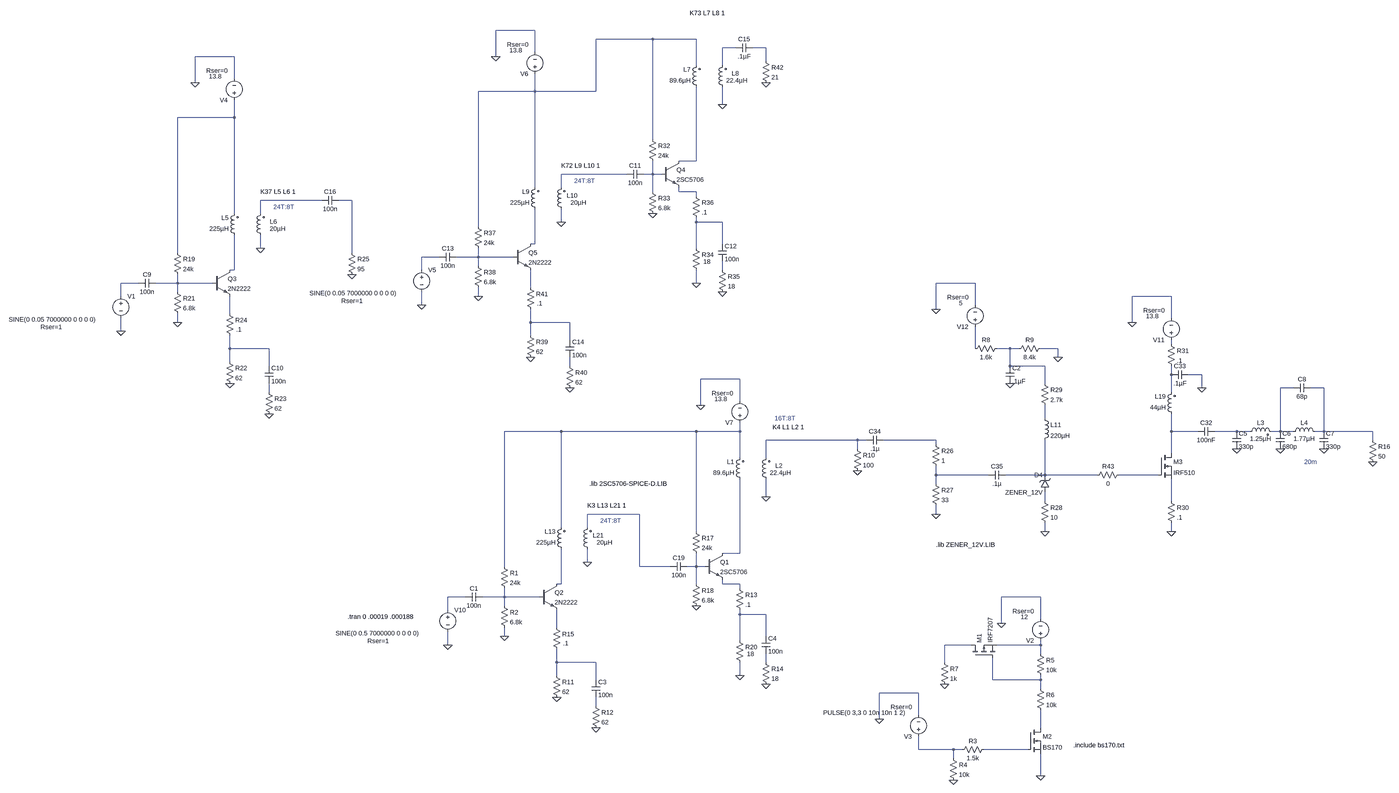
[diagram p0: schematic SSB Amp 7 MHz v2.asc, whole sheet]
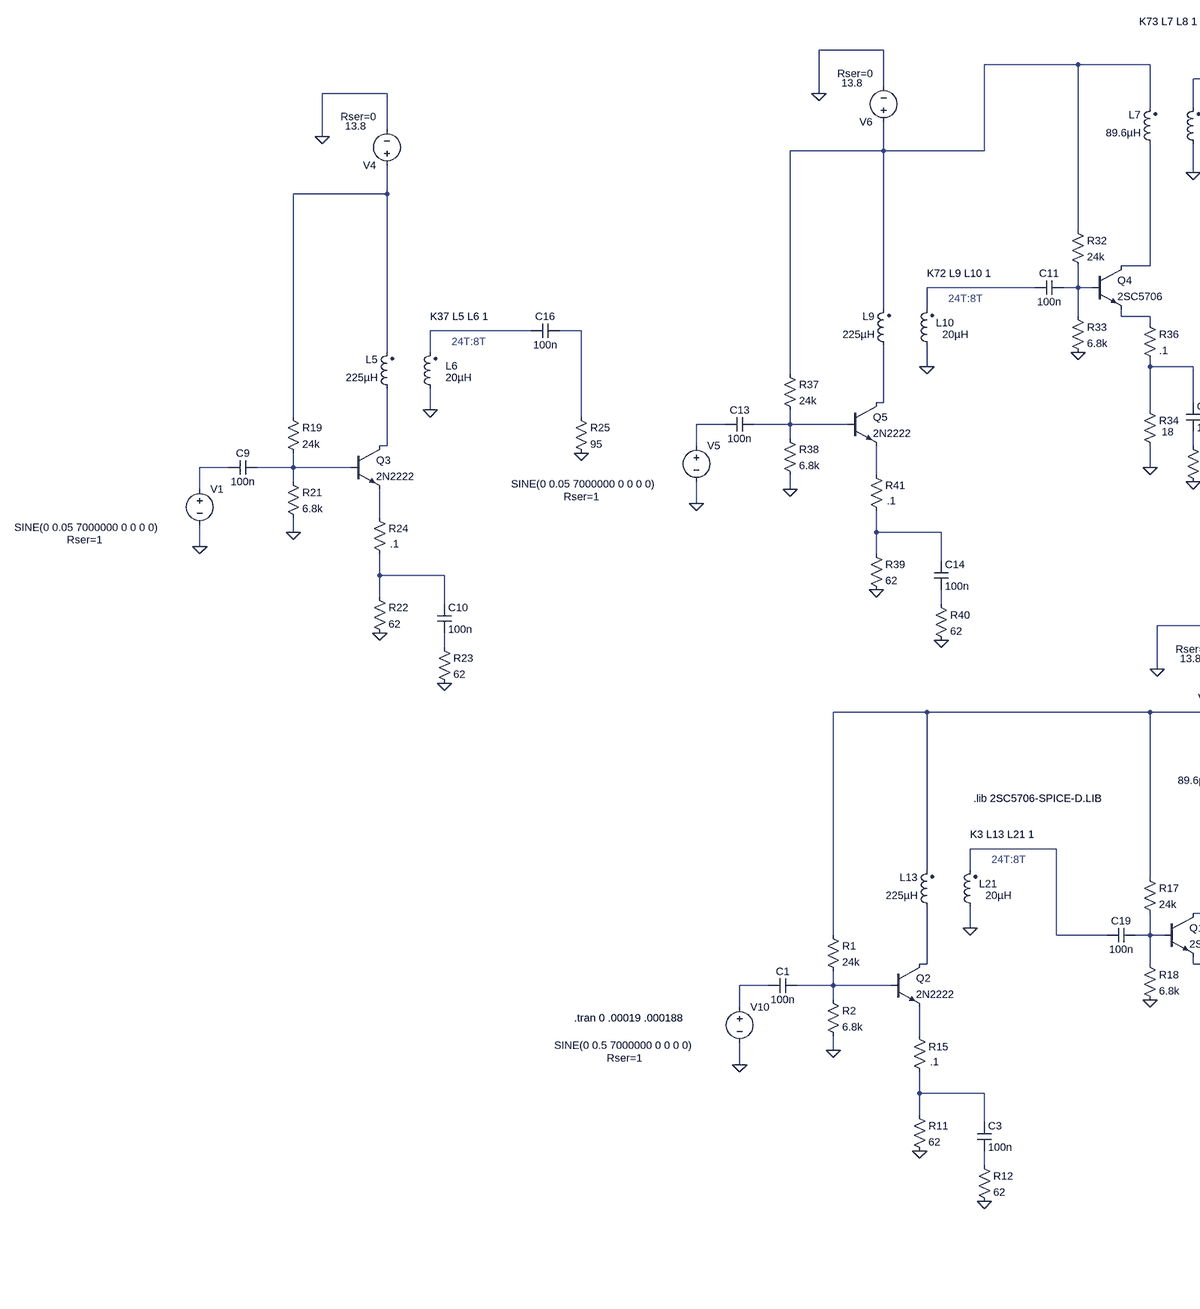
[diagram p1: schematic SSB Amp 7 MHz v2.asc, part, row 1 of 1, column 1 of 2]
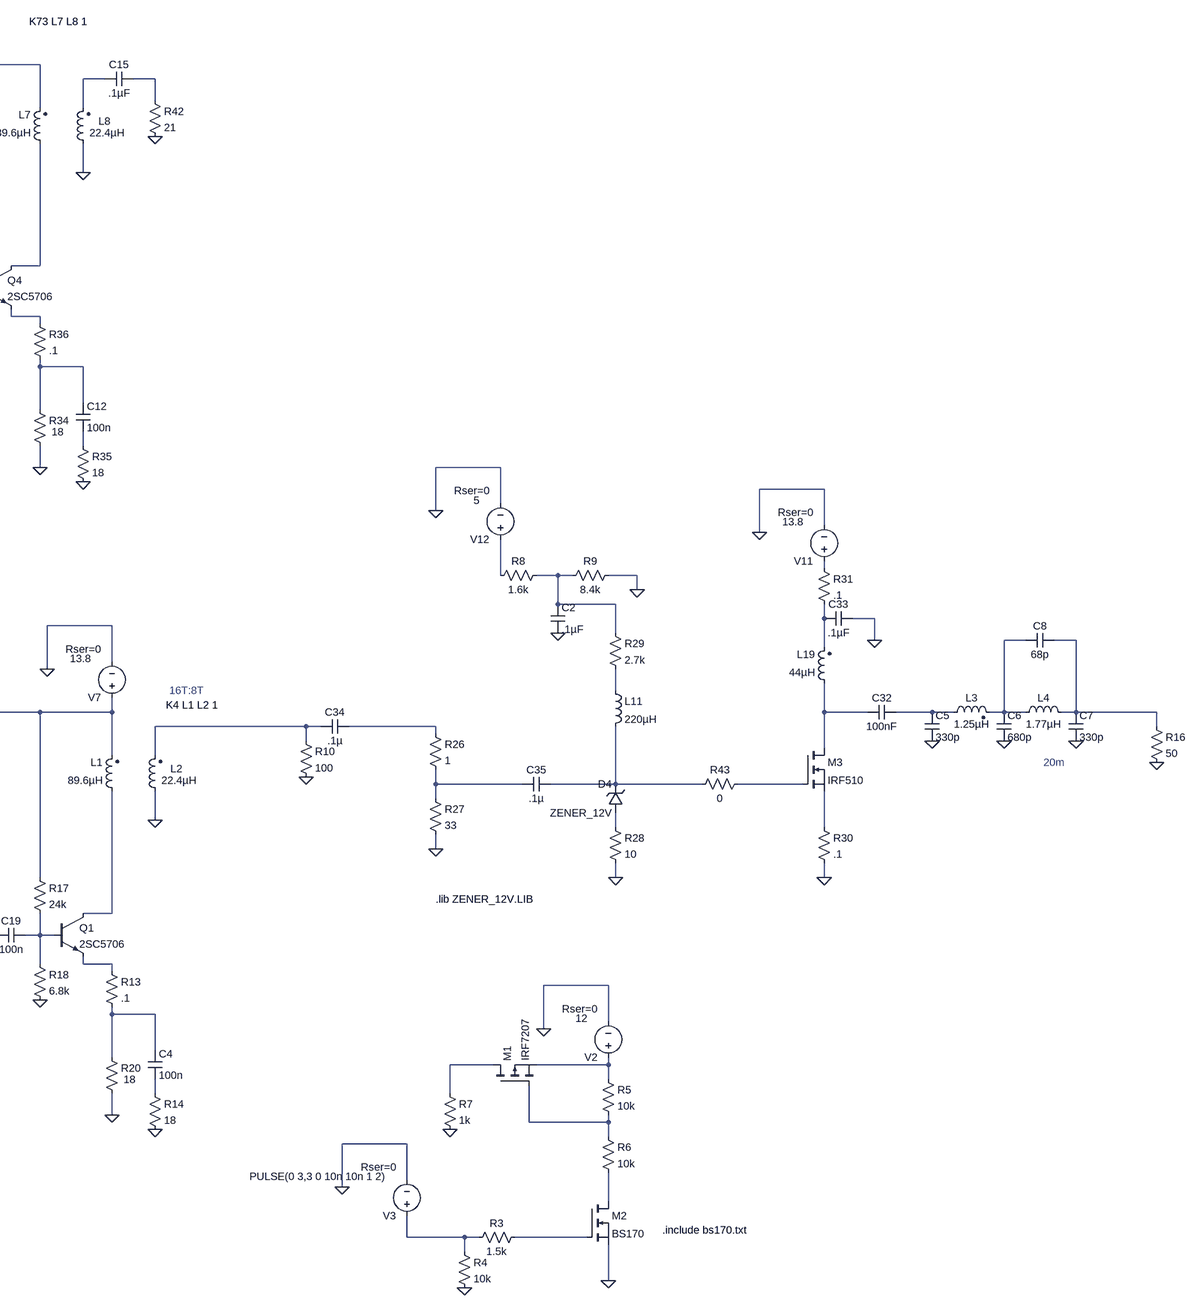
[diagram p2: schematic SSB Amp 7 MHz v2.asc, part, row 1 of 1, column 2 of 2]
SSB Amp 7 MHz v2.asc, the LTspice schematic file:
Version 4
SHEET 1 3764 1240
WIRE -1440 -4448 -1584 -4448
WIRE -1008 -4416 -1216 -4416
WIRE -848 -4416 -1008 -4416
WIRE -704 -4384 -752 -4384
WIRE -592 -4384 -640 -4384
WIRE -1440 -4368 -1440 -4448
WIRE -2544 -4352 -2688 -4352
WIRE -1584 -4352 -1584 -4448
WIRE -592 -4336 -592 -4384
WIRE -848 -4320 -848 -4416
WIRE -752 -4320 -752 -4384
WIRE -2544 -4272 -2544 -4352
WIRE -2688 -4256 -2688 -4352
WIRE -1440 -4224 -1440 -4288
WIRE -1440 -4224 -1648 -4224
WIRE -1216 -4224 -1216 -4416
WIRE -1216 -4224 -1440 -4224
WIRE -752 -4176 -752 -4240
WIRE -2544 -4128 -2544 -4192
WIRE -2544 -4128 -2752 -4128
WIRE -1008 -4048 -1008 -4416
WIRE -848 -3968 -848 -4240
WIRE -848 -3968 -912 -3968
WIRE -1104 -3920 -1344 -3920
WIRE -1008 -3920 -1008 -3968
WIRE -1008 -3920 -1040 -3920
WIRE -976 -3920 -1008 -3920
WIRE -1440 -3872 -1440 -4224
WIRE -1344 -3872 -1344 -3920
WIRE -1008 -3856 -1008 -3920
WIRE -912 -3856 -912 -3872
WIRE -848 -3856 -912 -3856
WIRE -848 -3840 -848 -3856
WIRE -2224 -3824 -2448 -3824
WIRE -2112 -3824 -2160 -3824
WIRE -2544 -3776 -2544 -4128
WIRE -2448 -3776 -2448 -3824
WIRE -1344 -3744 -1344 -3792
WIRE -848 -3744 -848 -3760
WIRE -752 -3744 -848 -3744
WIRE -1648 -3728 -1648 -4224
WIRE -1440 -3664 -1440 -3792
WIRE -1440 -3664 -1456 -3664
WIRE -752 -3664 -752 -3744
WIRE -2448 -3648 -2448 -3696
WIRE -848 -3648 -848 -3744
WIRE -2752 -3632 -2752 -4128
WIRE -2112 -3632 -2112 -3824
WIRE -1792 -3616 -1856 -3616
WIRE -1648 -3616 -1648 -3648
WIRE -1648 -3616 -1728 -3616
WIRE -1520 -3616 -1648 -3616
WIRE -1648 -3584 -1648 -3616
WIRE -2544 -3568 -2544 -3696
WIRE -2544 -3568 -2560 -3568
WIRE -1856 -3568 -1856 -3616
WIRE -752 -3568 -752 -3600
WIRE -2896 -3520 -2960 -3520
WIRE -2752 -3520 -2752 -3552
WIRE -2752 -3520 -2832 -3520
WIRE -2624 -3520 -2752 -3520
WIRE -848 -3520 -848 -3568
WIRE 176 -3520 32 -3520
WIRE -1456 -3504 -1456 -3568
WIRE -2752 -3488 -2752 -3520
WIRE -2960 -3472 -2960 -3520
WIRE -1648 -3472 -1648 -3504
WIRE 896 -3472 752 -3472
WIRE -1856 -3440 -1856 -3488
WIRE 176 -3440 176 -3520
WIRE 32 -3424 32 -3520
WIRE -2560 -3408 -2560 -3472
WIRE 896 -3392 896 -3472
WIRE -2752 -3376 -2752 -3408
WIRE -1456 -3376 -1456 -3424
WIRE -1312 -3376 -1456 -3376
WIRE 752 -3376 752 -3472
WIRE -2960 -3344 -2960 -3392
WIRE -1456 -3328 -1456 -3376
WIRE -1312 -3312 -1312 -3376
WIRE 896 -3296 896 -3312
WIRE -2560 -3280 -2560 -3328
WIRE -2416 -3280 -2560 -3280
WIRE 176 -3280 176 -3360
WIRE 304 -3280 256 -3280
WIRE 336 -3280 304 -3280
WIRE 480 -3280 416 -3280
WIRE 480 -3248 480 -3280
WIRE -2560 -3232 -2560 -3280
WIRE -2416 -3216 -2416 -3280
WIRE -1312 -3216 -1312 -3248
WIRE 304 -3216 304 -3280
WIRE 432 -3216 304 -3216
WIRE 896 -3184 896 -3216
WIRE 1008 -3184 960 -3184
WIRE -688 -3168 -832 -3168
WIRE 432 -3152 432 -3216
WIRE 1008 -3136 1008 -3184
WIRE 1344 -3136 1296 -3136
WIRE 1456 -3136 1408 -3136
WIRE -2416 -3120 -2416 -3152
WIRE 896 -3120 896 -3184
WIRE -688 -3088 -688 -3168
WIRE -832 -3072 -832 -3168
WIRE 432 -3024 432 -3072
WIRE -1344 -2976 -1552 -2976
WIRE -848 -2976 -1344 -2976
WIRE -688 -2976 -688 -3008
WIRE -688 -2976 -848 -2976
WIRE 896 -2976 896 -3040
WIRE 992 -2976 896 -2976
WIRE 1136 -2976 1056 -2976
WIRE 1184 -2976 1136 -2976
WIRE 1296 -2976 1296 -3136
WIRE 1296 -2976 1264 -2976
WIRE 1344 -2976 1296 -2976
WIRE 1456 -2976 1456 -3136
WIRE 1456 -2976 1424 -2976
WIRE 1824 -2976 1456 -2976
WIRE -256 -2944 -592 -2944
WIRE -224 -2944 -256 -2944
WIRE 32 -2944 -160 -2944
WIRE 1824 -2944 1824 -2976
WIRE 32 -2928 32 -2944
WIRE -256 -2912 -256 -2944
WIRE 896 -2896 896 -2976
WIRE -688 -2880 -688 -2976
WIRE -592 -2880 -592 -2944
WIRE 32 -2816 32 -2848
WIRE 224 -2816 32 -2816
WIRE 432 -2816 432 -2944
WIRE 432 -2816 288 -2816
WIRE 624 -2816 432 -2816
WIRE 848 -2816 704 -2816
WIRE 32 -2784 32 -2816
WIRE -592 -2736 -592 -2800
WIRE 432 -2720 432 -2752
WIRE 896 -2720 896 -2800
WIRE -1056 -2672 -1248 -2672
WIRE 32 -2672 32 -2704
WIRE -1344 -2624 -1344 -2976
WIRE -1248 -2624 -1248 -2672
WIRE -848 -2608 -848 -2976
WIRE 432 -2608 432 -2640
WIRE 896 -2608 896 -2640
WIRE -688 -2528 -688 -2800
WIRE -688 -2528 -752 -2528
WIRE -1248 -2496 -1248 -2544
WIRE -1552 -2480 -1552 -2976
WIRE -1056 -2480 -1056 -2672
WIRE -944 -2480 -1056 -2480
WIRE -848 -2480 -848 -2528
WIRE -848 -2480 -880 -2480
WIRE -816 -2480 -848 -2480
WIRE -1344 -2416 -1344 -2544
WIRE -1344 -2416 -1360 -2416
WIRE -848 -2416 -848 -2480
WIRE -752 -2416 -752 -2432
WIRE -688 -2416 -752 -2416
WIRE -688 -2400 -688 -2416
WIRE -1696 -2368 -1760 -2368
WIRE -1552 -2368 -1552 -2400
WIRE -1552 -2368 -1632 -2368
WIRE -1424 -2368 -1552 -2368
WIRE 416 -2368 272 -2368
WIRE -1552 -2336 -1552 -2368
WIRE -1760 -2320 -1760 -2368
WIRE -688 -2304 -688 -2320
WIRE -592 -2304 -688 -2304
WIRE 416 -2288 416 -2368
WIRE 272 -2272 272 -2368
WIRE -1360 -2256 -1360 -2320
WIRE -1552 -2224 -1552 -2256
WIRE -592 -2224 -592 -2304
WIRE -688 -2208 -688 -2304
WIRE -1760 -2192 -1760 -2240
WIRE 160 -2192 64 -2192
WIRE 416 -2192 416 -2208
WIRE 416 -2192 256 -2192
WIRE 416 -2160 416 -2192
WIRE -1360 -2128 -1360 -2176
WIRE -1216 -2128 -1360 -2128
WIRE -592 -2128 -592 -2160
WIRE 64 -2128 64 -2192
WIRE -1360 -2080 -1360 -2128
WIRE -688 -2080 -688 -2128
WIRE -1216 -2064 -1216 -2128
WIRE 240 -2064 240 -2144
WIRE 416 -2064 416 -2080
WIRE 416 -2064 240 -2064
WIRE 416 -2032 416 -2064
WIRE -32 -2016 -176 -2016
WIRE -1216 -1968 -1216 -2000
WIRE -32 -1936 -32 -2016
WIRE -176 -1920 -176 -2016
WIRE 416 -1888 416 -1952
WIRE -32 -1808 -32 -1856
WIRE 96 -1808 -32 -1808
WIRE 128 -1808 96 -1808
WIRE 368 -1808 208 -1808
WIRE 96 -1776 96 -1808
WIRE 416 -1712 416 -1792
FLAG -832 -3072 0
FLAG -848 -2336 0
FLAG -688 -2080 0
FLAG -1760 -2192 0
FLAG 752 -3376 0
FLAG 1008 -3136 0
FLAG 32 -2672 0
FLAG 432 -2608 0
FLAG 896 -2608 0
FLAG 32 -3424 0
FLAG -1552 -2224 0
FLAG 416 -1712 0
FLAG 96 -1696 0
FLAG 272 -2272 0
FLAG -176 -1920 0
FLAG 64 -2048 0
FLAG 480 -3248 0
FLAG 304 -3152 0
FLAG -256 -2832 0
FLAG -1360 -2000 0
FLAG -1216 -1888 0
FLAG -1248 -2496 0
FLAG -592 -2048 0
FLAG -592 -2736 0
FLAG 1824 -2864 0
FLAG 1136 -2912 0
FLAG 1296 -2912 0
FLAG 1456 -2912 0
FLAG -2960 -3344 0
FLAG -2752 -3376 0
FLAG -2560 -3152 0
FLAG -2416 -3040 0
FLAG -2448 -3648 0
FLAG -2112 -3552 0
FLAG -2688 -4256 0
FLAG -1008 -3776 0
FLAG -848 -3520 0
FLAG -752 -3488 0
FLAG -752 -4176 0
FLAG -1856 -3440 0
FLAG -1648 -3472 0
FLAG -1456 -3248 0
FLAG -1312 -3136 0
FLAG -1344 -3744 0
FLAG -1584 -4352 0
FLAG -592 -4256 0
SYMBOL npn -816 -2528 R0
SYMATTR InstName Q1
SYMATTR Value 2SC5706
SYMBOL voltage -688 -2992 R180
WINDOW 123 0 0 Left 0
WINDOW 39 24 124 Left 2
WINDOW 3 46 103 Left 2
SYMATTR SpiceLine Rser=0
SYMATTR Value 13.8
SYMATTR InstName V7
SYMBOL npn -1424 -2416 R0
SYMATTR InstName Q2
SYMATTR Value 2N2222
SYMBOL cap -880 -2496 R90
WINDOW 0 0 32 VBottom 2
WINDOW 3 32 32 VTop 2
SYMATTR InstName C19
SYMATTR Value 100n
SYMBOL res -864 -2624 R0
SYMATTR InstName R17
SYMATTR Value 24k
SYMBOL res -864 -2432 R0
SYMATTR InstName R18
SYMATTR Value 6.8k
SYMBOL ind2 -1328 -2528 R180
WINDOW 0 36 80 Left 2
WINDOW 3 36 40 Left 2
SYMATTR InstName L13
SYMATTR Value 225µH
SYMATTR Type ind
SYMBOL res -704 -2224 R0
WINDOW 3 42 65 Left 2
SYMATTR Value 18
SYMATTR InstName R20
SYMBOL voltage -1760 -2336 R0
WINDOW 123 0 0 Left 0
WINDOW 39 -295 129 Left 2
WINDOW 3 -412 101 Left 2
SYMATTR SpiceLine Rser=1
SYMATTR Value SINE(0 0.5 7000000 0 0 0 0)
SYMATTR InstName V10
SYMBOL voltage 896 -3296 R180
WINDOW 123 0 0 Left 0
WINDOW 39 24 124 Left 2
WINDOW 3 46 103 Left 2
SYMATTR SpiceLine Rser=0
SYMATTR Value 13.8
SYMATTR InstName V11
SYMBOL ind2 912 -3024 R180
WINDOW 0 36 80 Left 2
WINDOW 3 36 40 Left 2
SYMATTR InstName L19
SYMATTR Value 44µH
SYMATTR Type ind
SYMBOL cap 1056 -2992 R90
WINDOW 0 0 32 VBottom 2
WINDOW 3 32 32 VTop 2
SYMATTR InstName C32
SYMATTR Value 100nF
SYMBOL ind2 -1232 -2528 R180
WINDOW 0 -45 66 Left 2
WINDOW 3 -76 40 Left 2
SYMATTR InstName L21
SYMATTR Value 20µH
SYMATTR Type ind
SYMBOL cap 960 -3200 R90
WINDOW 0 0 32 VBottom 2
WINDOW 3 32 32 VTop 2
SYMATTR InstName C33
SYMATTR Value .1µF
SYMBOL cap -160 -2960 R90
WINDOW 0 0 32 VBottom 2
WINDOW 3 32 32 VTop 2
SYMATTR InstName C34
SYMATTR Value .1µ
SYMBOL zener 448 -2752 R180
WINDOW 0 24 64 Left 2
WINDOW 3 24 0 Left 2
SYMATTR InstName D4
SYMATTR Value ZENER_12V
SYMBOL res 16 -2944 R0
SYMATTR InstName R26
SYMATTR Value 1
SYMBOL res 16 -2800 R0
SYMATTR InstName R27
SYMATTR Value 33
SYMBOL cap 288 -2832 R90
WINDOW 0 0 32 VBottom 2
WINDOW 3 32 32 VTop 2
SYMATTR InstName C35
SYMATTR Value .1µ
SYMBOL res 416 -2736 R0
SYMATTR InstName R28
SYMATTR Value 10
SYMBOL nmos 848 -2896 R0
SYMATTR InstName M3
SYMATTR Value IRF510
SYMBOL res 416 -3168 R0
SYMATTR InstName R29
SYMATTR Value 2.7k
SYMBOL voltage 176 -3344 R180
WINDOW 123 0 0 Left 0
WINDOW 39 24 124 Left 2
WINDOW 3 46 103 Left 2
SYMATTR SpiceLine Rser=0
SYMATTR Value 5
SYMATTR InstName V12
SYMBOL res 880 -2736 R0
SYMATTR InstName R30
SYMATTR Value .1
SYMBOL res 880 -3312 R0
SYMATTR InstName R31
SYMATTR Value .1
SYMBOL cap -1632 -2384 R90
WINDOW 0 0 32 VBottom 2
WINDOW 3 32 32 VTop 2
SYMATTR InstName C1
SYMATTR Value 100n
SYMBOL res -1568 -2496 R0
SYMATTR InstName R1
SYMATTR Value 24k
SYMBOL res -1568 -2352 R0
SYMATTR InstName R2
SYMATTR Value 6.8k
SYMBOL nmos 368 -1888 R0
SYMATTR InstName M2
SYMATTR Value BS170
SYMATTR Prefix X
SYMBOL res 224 -1824 R90
WINDOW 0 0 56 VBottom 2
WINDOW 3 32 56 VTop 2
SYMATTR InstName R3
SYMATTR Value 1.5k
SYMBOL res 80 -1792 R0
SYMATTR InstName R4
SYMATTR Value 10k
SYMBOL voltage 416 -2192 R180
WINDOW 123 0 0 Left 0
WINDOW 39 24 124 Left 2
WINDOW 3 46 103 Left 2
SYMATTR SpiceLine Rser=0
SYMATTR Value 12
SYMATTR InstName V2
SYMBOL res 400 -2176 R0
SYMATTR InstName R5
SYMATTR Value 10k
SYMBOL res 400 -2048 R0
SYMATTR InstName R6
SYMATTR Value 10k
SYMBOL voltage -32 -1840 R180
WINDOW 123 0 0 Left 0
WINDOW 39 24 124 Left 2
WINDOW 3 46 103 Left 2
SYMATTR SpiceLine Rser=0
SYMATTR Value PULSE(0 3,3 0 10n 10n 1 2)
SYMATTR InstName V3
SYMBOL pmos 160 -2144 R270
SYMATTR InstName M1
SYMATTR Value IRF7207
SYMBOL res 48 -2144 R0
SYMATTR InstName R7
SYMATTR Value 1k
SYMBOL res 272 -3296 R90
WINDOW 0 0 56 VBottom 2
WINDOW 3 32 56 VTop 2
SYMATTR InstName R8
SYMATTR Value 1.6k
SYMBOL res 432 -3296 R90
WINDOW 0 0 56 VBottom 2
WINDOW 3 32 56 VTop 2
SYMATTR InstName R9
SYMATTR Value 8.4k
SYMBOL res -272 -2928 R0
SYMATTR InstName R10
SYMATTR Value 100
SYMBOL cap 288 -3216 R0
SYMATTR InstName C2
SYMATTR Value .1µF
SYMBOL res -1376 -2096 R0
SYMATTR InstName R11
SYMATTR Value 62
SYMBOL res -1232 -1984 R0
SYMATTR InstName R12
SYMATTR Value 62
SYMBOL cap -1232 -2064 R0
SYMATTR InstName C3
SYMATTR Value 100n
SYMBOL res -608 -2144 R0
SYMATTR InstName R14
SYMATTR Value 18
SYMBOL cap -608 -2224 R0
SYMATTR InstName C4
SYMATTR Value 100n
SYMBOL ind2 -672 -2784 R180
WINDOW 0 36 80 Left 2
WINDOW 3 36 40 Left 2
SYMATTR InstName L1
SYMATTR Value 89.6µH
SYMATTR Type ind
SYMBOL ind2 -576 -2784 R180
WINDOW 0 -45 66 Left 2
WINDOW 3 -76 40 Left 2
SYMATTR InstName L2
SYMATTR Value 22.4µH
SYMATTR Type ind
SYMBOL res -704 -2416 R0
SYMATTR InstName R13
SYMATTR Value .1
SYMBOL res -1376 -2272 R0
WINDOW 3 39 74 Left 2
SYMATTR Value .1
SYMATTR InstName R15
SYMBOL res 1808 -2960 R0
SYMATTR InstName R16
SYMATTR Value 50
SYMBOL cap 1120 -2976 R0
SYMATTR InstName C5
SYMATTR Value 330p
SYMBOL cap 1280 -2976 R0
SYMATTR InstName C6
SYMATTR Value 680p
SYMBOL cap 1440 -2976 R0
SYMATTR InstName C7
SYMATTR Value 330p
SYMBOL ind2 1168 -2960 R270
WINDOW 0 32 56 VTop 2
WINDOW 3 5 56 VBottom 2
SYMATTR InstName L3
SYMATTR Value 1.25µH
SYMATTR Type ind
SYMBOL ind 1328 -2960 R270
WINDOW 0 32 56 VTop 2
WINDOW 3 5 56 VBottom 2
SYMATTR InstName L4
SYMATTR Value 1.77µH
SYMBOL cap 1408 -3152 R90
WINDOW 0 0 32 VBottom 2
WINDOW 3 32 32 VTop 2
SYMATTR InstName C8
SYMATTR Value 68p
SYMBOL npn -2624 -3568 R0
SYMATTR InstName Q3
SYMATTR Value 2N2222
SYMBOL ind2 -2528 -3680 R180
WINDOW 0 36 80 Left 2
WINDOW 3 36 40 Left 2
SYMATTR InstName L5
SYMATTR Value 225µH
SYMATTR Type ind
SYMBOL voltage -2960 -3488 R0
WINDOW 123 0 0 Left 0
WINDOW 39 -295 129 Left 2
WINDOW 3 -412 101 Left 2
SYMATTR SpiceLine Rser=1
SYMATTR Value SINE(0 0.05 7000000 0 0 0 0)
SYMATTR InstName V1
SYMBOL ind2 -2432 -3680 R180
WINDOW 0 -45 66 Left 2
WINDOW 3 -76 40 Left 2
SYMATTR InstName L6
SYMATTR Value 20µH
SYMATTR Type ind
SYMBOL cap -2832 -3536 R90
WINDOW 0 0 32 VBottom 2
WINDOW 3 32 32 VTop 2
SYMATTR InstName C9
SYMATTR Value 100n
SYMBOL res -2768 -3648 R0
SYMATTR InstName R19
SYMATTR Value 24k
SYMBOL res -2768 -3504 R0
SYMATTR InstName R21
SYMATTR Value 6.8k
SYMBOL res -2576 -3248 R0
SYMATTR InstName R22
SYMATTR Value 62
SYMBOL res -2432 -3136 R0
SYMATTR InstName R23
SYMATTR Value 62
SYMBOL cap -2432 -3216 R0
SYMATTR InstName C10
SYMATTR Value 100n
SYMBOL res -2576 -3424 R0
WINDOW 3 39 74 Left 2
SYMATTR Value .1
SYMATTR InstName R24
SYMBOL res -2128 -3648 R0
SYMATTR InstName R25
SYMATTR Value 95
SYMBOL voltage -2544 -4176 R180
WINDOW 123 0 0 Left 0
WINDOW 39 24 124 Left 2
WINDOW 3 46 103 Left 2
SYMATTR SpiceLine Rser=0
SYMATTR Value 13.8
SYMATTR InstName V4
SYMBOL npn -976 -3968 R0
SYMATTR InstName Q4
SYMATTR Value 2SC5706
SYMBOL cap -1040 -3936 R90
WINDOW 0 0 32 VBottom 2
WINDOW 3 32 32 VTop 2
SYMATTR InstName C11
SYMATTR Value 100n
SYMBOL res -1024 -4064 R0
SYMATTR InstName R32
SYMATTR Value 24k
SYMBOL res -1024 -3872 R0
SYMATTR InstName R33
SYMATTR Value 6.8k
SYMBOL res -864 -3664 R0
WINDOW 3 42 65 Left 2
SYMATTR Value 18
SYMATTR InstName R34
SYMBOL res -768 -3584 R0
SYMATTR InstName R35
SYMATTR Value 18
SYMBOL cap -768 -3664 R0
SYMATTR InstName C12
SYMATTR Value 100n
SYMBOL ind2 -832 -4224 R180
WINDOW 0 36 80 Left 2
WINDOW 3 36 40 Left 2
SYMATTR InstName L7
SYMATTR Value 89.6µH
SYMATTR Type ind
SYMBOL ind2 -736 -4224 R180
WINDOW 0 -45 66 Left 2
WINDOW 3 -76 40 Left 2
SYMATTR InstName L8
SYMATTR Value 22.4µH
SYMATTR Type ind
SYMBOL res -864 -3856 R0
SYMATTR InstName R36
SYMATTR Value .1
SYMBOL npn -1520 -3664 R0
SYMATTR InstName Q5
SYMATTR Value 2N2222
SYMBOL ind2 -1424 -3776 R180
WINDOW 0 36 80 Left 2
WINDOW 3 36 40 Left 2
SYMATTR InstName L9
SYMATTR Value 225µH
SYMATTR Type ind
SYMBOL voltage -1856 -3584 R0
WINDOW 123 0 0 Left 0
WINDOW 39 -295 129 Left 2
WINDOW 3 -412 101 Left 2
SYMATTR SpiceLine Rser=1
SYMATTR Value SINE(0 0.05 7000000 0 0 0 0)
SYMATTR InstName V5
SYMBOL ind2 -1328 -3776 R180
WINDOW 0 -45 66 Left 2
WINDOW 3 -76 40 Left 2
SYMATTR InstName L10
SYMATTR Value 20µH
SYMATTR Type ind
SYMBOL cap -1728 -3632 R90
WINDOW 0 0 32 VBottom 2
WINDOW 3 32 32 VTop 2
SYMATTR InstName C13
SYMATTR Value 100n
SYMBOL res -1664 -3744 R0
SYMATTR InstName R37
SYMATTR Value 24k
SYMBOL res -1664 -3600 R0
SYMATTR InstName R38
SYMATTR Value 6.8k
SYMBOL res -1472 -3344 R0
SYMATTR InstName R39
SYMATTR Value 62
SYMBOL res -1328 -3232 R0
SYMATTR InstName R40
SYMATTR Value 62
SYMBOL cap -1328 -3312 R0
SYMATTR InstName C14
SYMATTR Value 100n
SYMBOL res -1472 -3520 R0
WINDOW 3 39 74 Left 2
SYMATTR Value .1
SYMATTR InstName R41
SYMBOL voltage -1440 -4272 R180
WINDOW 123 0 0 Left 0
WINDOW 39 24 124 Left 2
WINDOW 3 46 103 Left 2
SYMATTR SpiceLine Rser=0
SYMATTR Value 13.8
SYMATTR InstName V6
SYMBOL res -608 -4352 R0
SYMATTR InstName R42
SYMATTR Value 21
SYMBOL cap -640 -4400 R90
WINDOW 0 0 32 VBottom 2
WINDOW 3 32 32 VTop 2
SYMATTR InstName C15
SYMATTR Value .1µF
SYMBOL cap -2160 -3840 R90
WINDOW 0 0 32 VBottom 2
WINDOW 3 32 32 VTop 2
SYMATTR InstName C16
SYMATTR Value 100n
SYMBOL res 720 -2832 R90
WINDOW 0 0 56 VBottom 2
WINDOW 3 32 56 VTop 2
SYMATTR InstName R43
SYMATTR Value 0
SYMBOL ind 416 -3040 R0
SYMATTR InstName L11
SYMATTR Value 220µH
TEXT -1240 -2784 Left 2 !.lib 2SC5706-SPICE-D.LIB
TEXT -568 -2992 Left 2 !K4 L1 L2 1
TEXT -2128 -2296 Left 2 !.tran 0 .00019 .000188
TEXT 536 -1824 Left 2 !.include bs170.txt
TEXT -1248 -2704 Left 2 !K3 L13 L21 1
TEXT 32 -2560 Left 2 !.lib ZENER_12V.LIB
TEXT 1384 -2864 Left 2 ;20m
TEXT -1200 -2648 Left 2 ;24T:8T
TEXT -560 -3024 Left 2 ;16T:8T
TEXT -2448 -3856 Left 2 !K37 L5 L6 1
TEXT -2400 -3800 Left 2 ;24T:8T
TEXT -1344 -3952 Left 2 !K72 L9 L10 1
TEXT -1296 -3896 Left 2 ;24T:8T
TEXT -872 -4512 Left 2 !K73 L7 L8 1

The netlist it stands for:
* SSB Amp 7 MHz v2.asc
Q1 N043 N044 N046 0 2SC5706
V7 N032 0 13.8 Rser=0
Q2 N045 N048 N050 0 2N2222
C19 N044 N042 100n
R17 N032 N044 24k
R18 N044 0 6.8k
L13 N045 N032 225µH
R20 N049 0 18
V10 N047 0 SINE(0 0.5 7000000 0 0 0 0) Rser=1
V11 N022 0 13.8 Rser=0
L19 N033 N027 44µH
C32 N034 N033 100nF
L21 0 N042 20µH
C33 0 N027 .1µF
C34 N036 N035 .1µ
D4 N040 N038 ZENER_12V
R26 N036 N037 1
R27 N037 0 33
C35 N038 N037 .1µ
R28 N040 0 10
M3 N033 N039 N041 N041 IRF510
R29 N025 N031 2.7k
V12 N024 0 5 Rser=0
R30 N041 0 .1
R31 N022 N027 .1
C1 N048 N047 100n
R1 N032 N048 24k
R2 N048 0 6.8k
XM2 N057 N059 0 BS170  ; pins D G S
R3 N059 N058 1.5k
R4 N058 0 10k
V2 N052 0 12 Rser=0
R5 N052 N055 10k
R6 N055 N057 10k
V3 N058 0 PULSE(0 3,3 0 10n 10n 1 2) Rser=0
M1 N051 N055 N052 N052 IRF7207
R7 N051 0 1k
R8 N025 N024 1.6k
R9 0 N025 8.4k
R10 N035 0 100
C2 N025 0 .1µF
R11 N053 0 62
R12 N056 0 62
C3 N053 N056 100n
R14 N054 0 18
C4 N049 N054 100n
L1 N043 N032 89.6µH
L2 0 N035 22.4µH
R13 N046 N049 .1
R15 N050 N053 .1
R16 N029 0 50
C5 N034 0 330p
C6 N028 0 680p
C7 N029 0 330p
L3 N034 N028 1.25µH
L4 N028 N029 1.77µH
C8 N029 N028 68p
Q3 N015 N018 N020 0 2N2222
L5 N015 N004 225µH
V1 N017 0 SINE(0 0.05 7000000 0 0 0 0) Rser=1
L6 0 N009 20µH
C9 N018 N017 100n
R19 N004 N018 24k
R21 N018 0 6.8k
R22 N023 0 62
R23 N030 0 62
C10 N023 N030 100n
R24 N020 N023 .1
R25 N010 0 95
V4 N004 0 13.8 Rser=0
Q4 N005 N007 N008 0 2SC5706
C11 N007 N006 100n
R32 N001 N007 24k
R33 N007 0 6.8k
R34 N011 0 18
R35 N016 0 18
C12 N011 N016 100n
L7 N005 N001 89.6µH
L8 0 N002 22.4µH
R36 N008 N011 .1
Q5 N012 N014 N019 0 2N2222
L9 N012 N001 225µH
V5 N013 0 SINE(0 0.05 7000000 0 0 0 0) Rser=1
L10 0 N006 20µH
C13 N014 N013 100n
R37 N001 N014 24k
R38 N014 0 6.8k
R39 N021 0 62
R40 N026 0 62
C14 N021 N026 100n
R41 N019 N021 .1
V6 N001 0 13.8 Rser=0
R42 N003 0 21
C15 N003 N002 .1µF
C16 N010 N009 100n
R43 N039 N038 0
L11 N031 N038 220µH
.model D D
.lib standard.dio
.model NPN NPN
.model PNP PNP
.lib standard.bjt
.model NMOS NMOS
.model PMOS PMOS
.lib standard.mos
.lib 2SC5706-SPICE-D.LIB
K4 L1 L2 1
.tran 0 .00019 .000188
.include bs170.txt
K3 L13 L21 1
.lib ZENER_12V.LIB
* 20m
* 24T:8T
* 16T:8T
K37 L5 L6 1
* 24T:8T
K72 L9 L10 1
* 24T:8T
K73 L7 L8 1
.backanno
.end